# Altium schematic sheet PWR.SchDoc
size A4
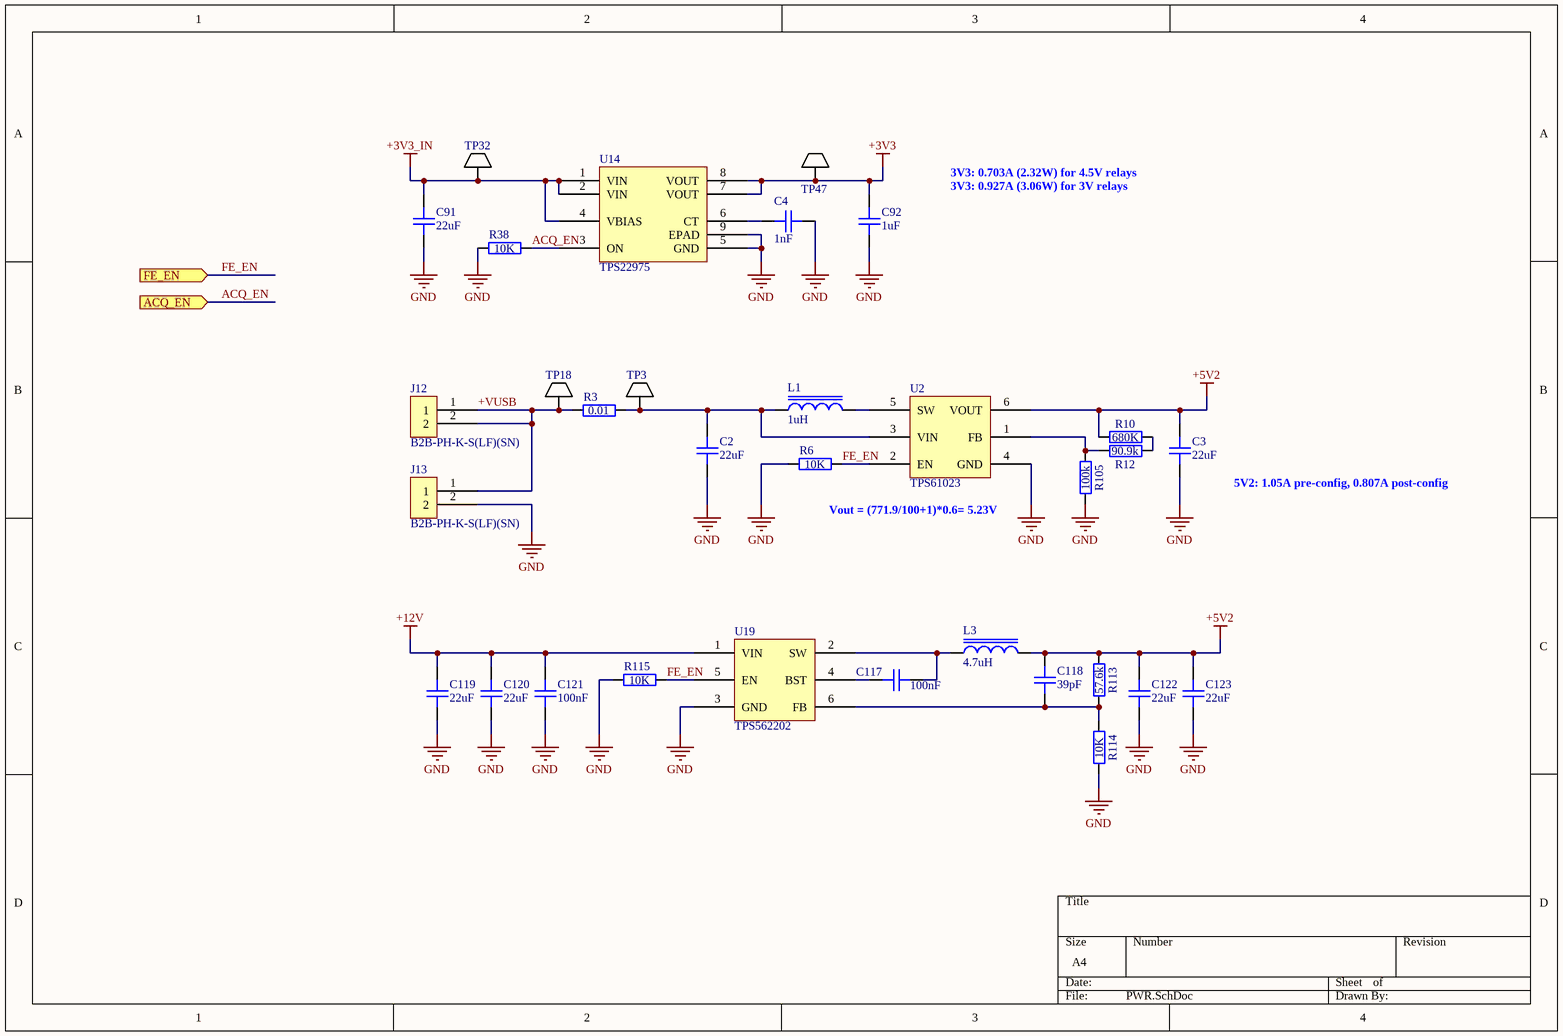
[diagram p0: PWR.SchDoc]

## Parts
C2  22uF  [GEN_C_0805]
C3  22uF  [GEN_C_0805]
C4  1nF  [GEN_C_0402]
C91  22uF  [GEN_C_0805]
C92  1uF  [GEN_C_0402]
C117  100nF  [GEN_C_0402]
C118  39pF  [GEN_C_0402]
C119  22uF  [GEN_C_0805]
C120  22uF  [GEN_C_0805]
C121  100nF  [GEN_C_0402]
C122  22uF  [GEN_C_0805]
C123  22uF  [GEN_C_0805]
J12  B2B-PH-K-S(LF)(SN)  [JST_B2B-PH-K-S(LF)(SN)]
J13  B2B-PH-K-S(LF)(SN)  [JST_B2B-PH-K-S(LF)(SN)]
L1  1uH  [GEN_L_1210]
L3  4.7uH  [TY_IND_NRS5030]
R3  0.01  [GEN_R_0603]
R6  10K  [GEN_R_0402]
R10  680K  [GEN_R_0402]
R12  90.9k  [GEN_R_0402]
R38  10K  [GEN_R_0402]
R105  100k  [GEN_R_0402]
R113  57.6k  [GEN_R_0402]
R114  10K  [GEN_R_0402]
R115  10K  [GEN_R_0402]
TP3  5015  [KEY_5015]  (value not drawn)
TP18  5015  [KEY_5015]  (value not drawn)
TP32  5015  [KEY_5015]  (value not drawn)
TP47  5015  [KEY_5015]  (value not drawn)
U2  TPS61023  [TI_SOT563_DRL0006A]
U14  TPS22975  [TI_WSON8_DSG0008A]
U19  TPS562202  [TI_SOT563_DRL0006A]

## Ports
ACQ_EN (in), FE_EN (in)

## Nets
+3V3: C92.2 TP47.1 U14.7(VOUT) U14.8(VOUT)
+3V3_IN: C91.2 TP32.1 U14.1(VIN) U14.2(VIN) U14.4(VBIAS)
+5V2: C3.2 C118.2 C122.2 C123.2 L3.2 R10.2 R113.2 U2.6(VOUT)
+12V: C119.2 C120.2 C121.1 U19.1(VIN)
GND: C2.1 C3.1 C4.1 C91.1 C92.1 C119.1 C120.1 C121.2 C122.1 C123.1 J13.2 R6.2 R38.1 R105.1 R114.1 R115.2 U2.4(GND) U14.5(GND) U14.9(EPAD) U19.3(GND)
+VUSB: J12.1 J12.2 J13.1 R3.2 TP18.1
ACQ_EN: R38.2 U14.3(ON) ; port ACQ_EN
FE_EN: R6.1 R115.1 U2.2(EN) U19.5(EN) ; port FE_EN
NetC2_2: C2.2 L1.1 R3.1 TP3.1 U2.3(VIN)
NetC4_2: C4.2 U14.6(CT)
NetC117_1: C117.1 L3.1 U19.2(SW)
NetC117_2: C117.2 U19.4(BST)
NetC118_1: C118.1 R113.1 R114.2 U19.6(FB)
NetL1_2: L1.2 U2.5(SW)
NetR10_1: R10.1 R12.2
NetR12_1: R12.1 R105.2 U2.1(FB)

## Notes on the sheet
- 3V3: 0.703A (2.32W) for 4.5V relays
- 3V3: 0.927A (3.06W) for 3V relays
- Vout = (771.9/100+1)*0.6= 5.23V
- 5V2: 1.05A pre-config, 0.807A post-config

## Library data of the parts
C2 C3 C91 C119 C120 C122 C123 = CAP 22uF 25V X5R 0805: Voltage Rating: 25V; Package: 0805; Value: 22uF; Supplier 1: Digi-Key; Supplier Part Number 1: 490-10749-1-ND
C4 = CAP 1nF 50V C0G 0402: Voltage Rating: 50V; Package: 0402; Supplier 1: Digi-Key; Supplier Part Number 1: 490-6189-1-ND; Value: 1nF
C92 = CAP 1uF 25V X5R 0402: Voltage Rating: 25V; Package: 0402; Value: 1uF; Supplier 1: Digi-Key; Supplier Part Number 1: 490-10017-1-ND
C117 C121 = CAP 100nF 16V X7R 0402: Voltage Rating: 16V; Package: 0402; Supplier 1: Digi-Key; Supplier Part Number 1: 490-4759-1-ND; Value: 100nF
C118 = CAP 39pF 50V C0G 0402: Manufacturer: KEMET; House Part Number: C-39pF-0402-002; Manufacturer Part Number: C0402C390J5GACTU; Temperature Coefficient: C0G; Voltage Rating: 50V; Package: 0402; Value: 39pF; Supplier 1: Digi-Key; Supplier Part Number 1: 399-C0402C390J5GAC7867CT-ND
J12 J13 = CONN JST PH 2 Pin TH: Supplier 1: Digi-Key; Supplier Part Number 1: 455-1704-ND
L1 = IND 1uH 3.1A 45 MOHM 1210: Value: 1uH; Supplier 1: Digi-Key; Supplier Part Number 1: 490-10590-1-ND
L3 = IND 4.7uH 2.6A 35 MOHM SMD: Value: 4.7uH; Supplier 1: Digi-Key; Supplier Part Number 1: 587-3461-1-ND
R3 = RES 0.01 OHM 1% 1/4W 0603: Tolerance: 1%; Power Rating: 0.25W; Supplier 1: Digi-Key; Supplier Part Number 1: 408-1404-1-ND; Value: 0.01; Package: 0603
R6 R38 R114 R115 = RES 10K OHM 1% 1/10W 0402: Tolerance: 1%; Power Rating: 0.1W; Package: 0402; Supplier 1: Digi-Key; Supplier Part Number 1: P10.0KLCT-ND; Value: 10K
R10 = RES 680K OHM 1% 1/16W 0402: Manufacturer: Yageo; Manufacturer Part Number: RC0402FR-07681KL; Tolerance: 1%; Package: 0402; Supplier 1: Digi-Key; Supplier Part Number 1: YAG3211CT-ND; Value: 680K
R12 = RES 90.9K OHM 1% 1/16W 0402: Tolerance: 1%; Power Rating: 0.0625W; Package: 0402; Supplier 1: Digi-Key; Supplier Part Number 1: 311-90.9KLRCT-ND; Value: 90.9k
R105 = RES 100K OHM 1% 1/10W 0402: Tolerance: 1%; Power Rating: 0.1W; Package: 0402; Supplier 1: Digi-Key; Supplier Part Number 1: 311-100KLRCT-ND; Value: 100k
R113 = RES 57.6K OHM 1% 1/16W 0402: Tolerance: 1%; Power Rating: 0.0625W; Package: 0402; Value: 57.6k; Supplier 1: Digi-Key; Supplier Part Number 1: YAG3190CT-ND
TP3 TP18 TP32 TP47 = TP KEYSTONE 5015: Supplier 1: Digi-Key; Supplier Part Number 1: 36-5015CT-ND
U2 = IC BOOST TPS61023: Supplier 1: Digi-Key; Supplier Part Number 1: 296-TPS61023DRLTCT-ND
U14 = IC SWITCH LOAD TPS22975: Supplier 1: Digi-Key; Supplier Part Number 1: 296-47228-1-ND
U19 = IC BUCK TPS562202: Supplier 1: Digi-Key; Supplier Part Number 1: 296-TPS562202DRLRCT-ND